# EAGLE design IRre (EAGLE 8.1.1)
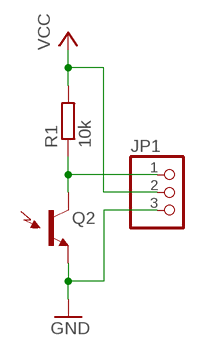
[diagram p0: schematic, sheet 1]

## Parts
JP1  PINHD-1X3  [1X03]
Q2  LTR-301  [LTR-301]
R1  10k  R-EU_R0805  [R0805]

## Nets
GND: JP1.3 Q2.E(E1)
N$2: JP1.1 Q2.C(C1) R1.1
VCC: JP1.2 R1.2

## Library data of the parts
JP1 = pinhead:PINHD-1X3: PIN HEADER
Q2 = SparkFun-Sensors:LTR-301: LiteOn LTR-301 IR Phototransistor (Side-Receiving) Side-looking Infrared detectors. These simple devices operate at 940nm and work well for generic IR systems including remote control and touch-less object sensing. Using a simple ADC on any microcontroller will allow variable readings to be collected from the detector. Datasheet <http://www.sparkfun.com/datasheets/Components/LTR-301.pdf> SparkFun Products Infrared Emitters and Detectors <https://www.sparkfun.com/products/241> (SEN-00241); PROD_ID: DIO-10904; SF_ID: SEN-00241
R1 = resistor:R-EU_: RESISTOR, European symbol

## Board
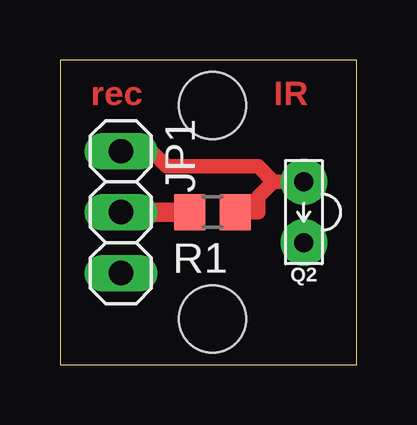
[diagram p1: board, top side]
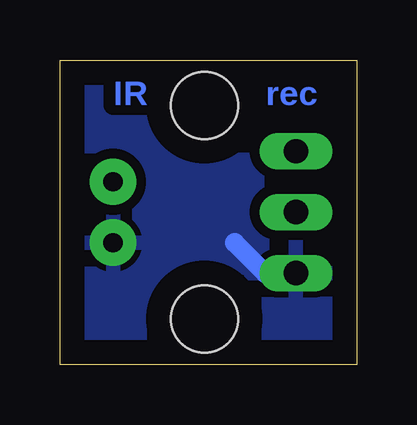
[diagram p2: board, bottom side, seen from below]

Size 12.37 x 12.69 mm. Coordinates in mm from the lower left corner, seen from the top.
Outline: 0,0 12.37,0 12.37,12.69 0,12.69 0,0
Copper layers (1*16): Top 0.035mm / dielectric 1.5mm / Bottom 0.035mm
Design rules "default": minimum track width 10mil, minimum drill 24mil, track to track 8mil, track to pad 8mil, pad to pad 8mil, via to via 8mil, smd to smd 8mil, copper to edge 40mil, drill to drill 8mil, minimum pad ring 10mil, minimum via ring 8mil, stop-mask expansion 4mil, vias tented up to drill 0mil, thermal gap 10mil
Holes 2.8 mm at 6.35,10.79 6.35,1.91

### Footprints (pad centres in the part's own frame; a part is rotated, then mirrored left to right if it is on the bottom)
1X03 = drill 1.016 long: 1 -2.54,0; 2 0,0; 3 2.54,0
LTR-301 = drill 0.8 pad 1.93: C 1.27,0; E -1.27,0
R0805 = smd 1.3 x 1.5: 1 -0.95,0; 2 0.95,0

### Placement (x,y rotation side)
JP1  2.54,6.35 270 top
Q2  10.16,6.35 90 top
R1  6.35,6.35 180 top

### Tracks (layer width: path | path; a pad name or v marks a point on that pad's centre or on a via)
GND
  Bottom 0.813: JP1.3 3.81,3.81 5.08,5.08
  pour Bottom (isolate 0.406): 0,12.7 12.7,12.7 12.7,0 0,0
N$2
  Top 0.61: 7.62,6.35 R1.1 8.26,6.35 8.26,6.99 8.89,7.62 | 8.89,7.62 Q2.C | 8.89,7.62 8.26,8.26 4.45,8.26 3.81,8.89 JP1.1
VCC
  Top 0.813: R1.2 JP1.2

### Text on the board
Top: rec | IR
Bottom: rec | IR